# Altium schematic sheet ImprovedBlackPill.SchDoc
size A4; SheetNumber: 1; SheetTotal: 3
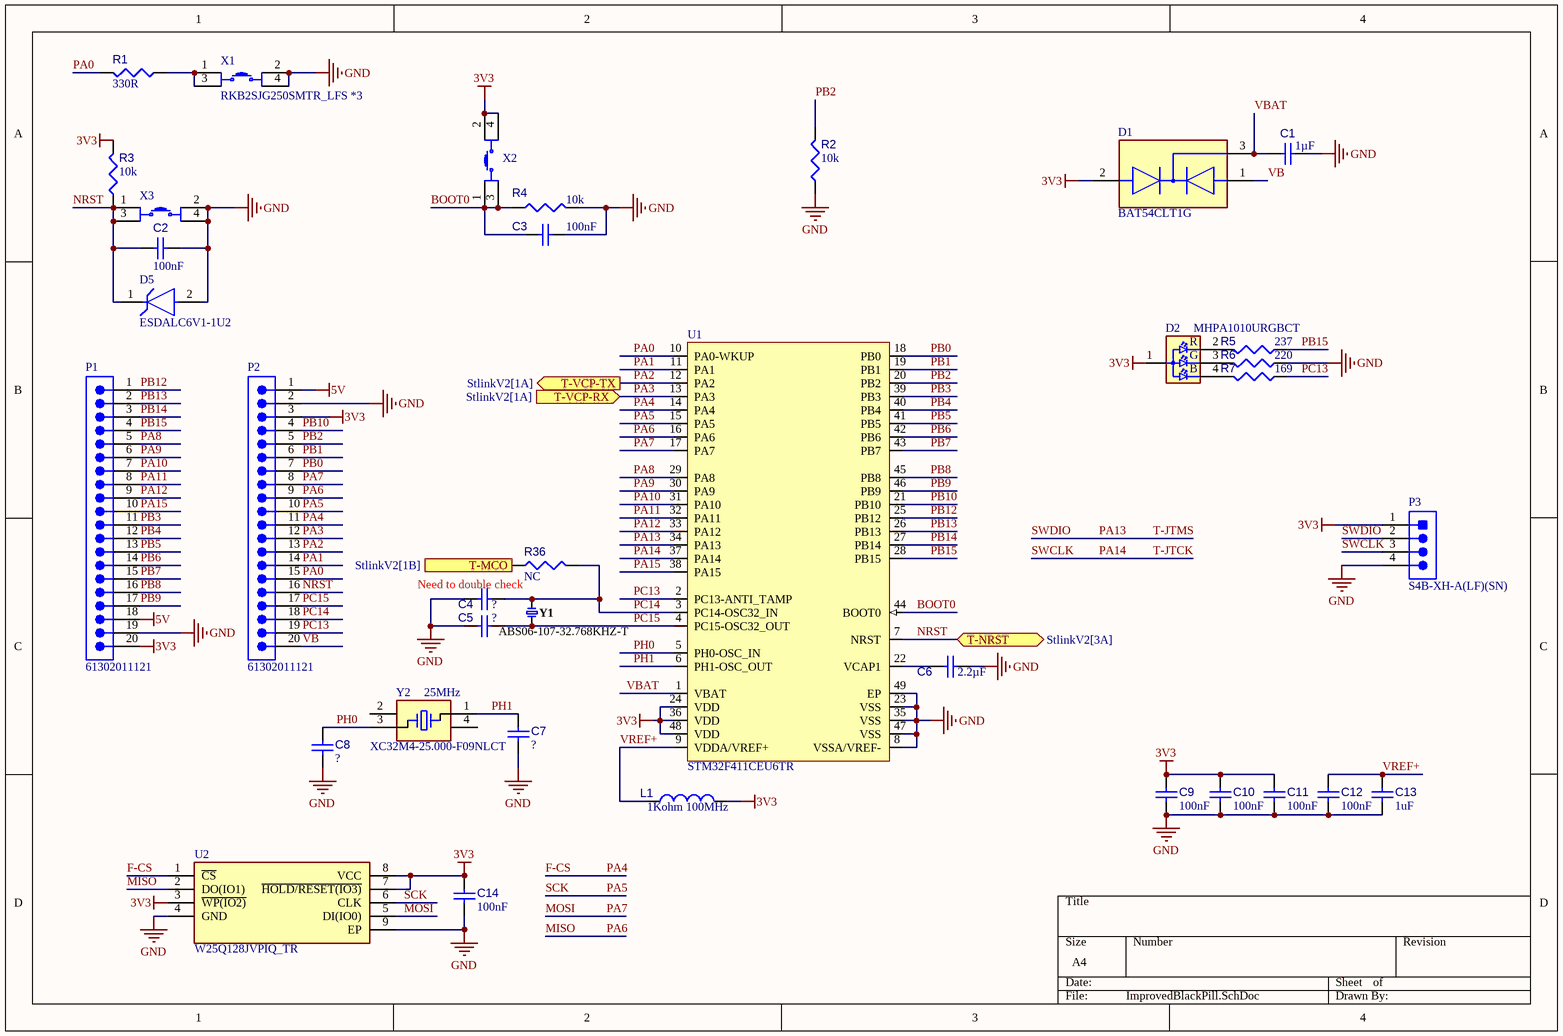
[diagram p0: ImprovedBlackPill.SchDoc]

## Parts
C1  value 1µF  [CAPC1005X55X25ML05T10]  (hidden comment: Capacitor 1 uF +/- 10% 6.3 V 0402)
C2  value 100nF  [CAPC1005X55X25ML05T05]  (hidden comment: Capacitor 10 pF +/- 5% 50 V 0402)
C3  value 100nF  [CAPC1005X55X25ML05T05]  (hidden comment: Capacitor 10 pF +/- 5% 50 V 0402)
C4  Capacitor 10 pF +/- 5% 50 V 0402  [CAPC1005X55X25ML05T05]  (value not drawn)
C5  Capacitor 10 pF +/- 5% 50 V 0402  [CAPC1005X55X25ML05T05]  (value not drawn)
C6  value 2.2µF  [CAPC2013X135X45NL10T25]  (hidden comment: Capacitor 1 uF +/- 10% 50 V 0805)
C7  Capacitor 10 pF +/- 5% 50 V 0402  [CAPC1005X55X25ML05T05]  (value not drawn)
C8  Capacitor 10 pF +/- 5% 50 V 0402  [CAPC1005X55X25ML05T05]  (value not drawn)
C9  value 100nF  [CAPC1005X55X25ML05T05]  (hidden comment: Capacitor 10 pF +/- 5% 50 V 0402)
C10  value 100nF  [CAPC1005X55X25ML05T05]  (hidden comment: Capacitor 10 pF +/- 5% 50 V 0402)
C11  value 100nF  [CAPC1005X55X25ML05T05]  (hidden comment: Capacitor 10 pF +/- 5% 50 V 0402)
C12  value 100nF  [CAPC1005X55X25ML05T05]  (hidden comment: Capacitor 10 pF +/- 5% 50 V 0402)
C13  value 1uF  [CAPC1005X55X25ML05T05]  (hidden comment: Capacitor 10 pF +/- 5% 50 V 0402)
C14  value 100nF  [CAPC1005X55X25ML05T05]  (hidden comment: Capacitor 10 pF +/- 5% 50 V 0402)
D1  BAT54CLT1G  [FP-318-08-IPC_C]
D2  MHPA1010URGBCT  [FP-SML-LX0404SIUPGUSB-MFG]
D5  ESDALC6V1-1U2  [FP-ST0201-MFG]
L1  value 1Kohm 100MHz  [MURA-LQP15MN3N6B02D-2_N]  (hidden comment: LQP15MN3N6B02D)
P1  61302011121  [61302011121]
P2  61302011121  [61302011121]
P3  S4B-XH-A(LF)(SN)  [JST-S4B-XH-A(LF)(SN)_V]
R1  value 330R  [RESC1005X40X25ML10T10]  (hidden comment: Resistor 15k +/-1% 0402 63 mW)
R2  value 10k  [RESC1005X40X25ML10T10]  (hidden comment: Resistor 15k +/-1% 0402 63 mW)
R3  value 10k  [RESC1005X40X25ML10T10]  (hidden comment: Resistor 15k +/-1% 0402 63 mW)
R4  value 10k  [RESC1005X40X25ML10T10]  (hidden comment: Resistor 15k +/-1% 0402 63 mW)
R5  value 237  [RESC1005X40X25ML10T10]  (hidden comment: Resistor 15k +/-1% 0402 63 mW)
R6  value 220  [RESC1005X40X25ML10T10]  (hidden comment: Resistor 15k +/-1% 0402 63 mW)
R7  value 169  [RESC1005X40X25ML10T10]  (hidden comment: Resistor 15k +/-1% 0402 63 mW)
R36  value NC  [RESC0402(1005)_L]  (hidden comment: Jumper 0402)
U1  STM32F411CEU6TR  [STM-UFQFPN48_N]
U2  W25Q128JVPIQ_TR  [SON127P600X500X80-9N-D]
X1  RKB2SJG250SMTR_LFS *3  [RKB2SJG250SMTRLFS]
X2  RKB2SJG250SMTR_LFS  [RKB2SJG250SMTRLFS]  (value not drawn)
X3  RKB2SJG250SMTR_LFS  [RKB2SJG250SMTRLFS]  (value not drawn)
Y1  ABS06-107-32.768KHZ-T  [FP-ABS06-MFG]
Y2  XC32M4-25.000-F09NLCT  [830105863709]

## Ports
T-MCO (out, see StlinkV2[1B]), T-NRST (bidir, see StlinkV2[3A]), T-VCP-RX (in, see StlinkV2[1A]), T-VCP-TX (out, see StlinkV2[1A])

## Nets
3V3: C9.2 C10.2 C11.2 C14.2 D1.2(2_ANODE) D2.1(Common_Anode) L1.1 P1.20 P2.3 P3.1 R3.2 U1.24(VDD) U1.36(VDD) U1.48(VDD) U2.3(~{WP}~{(IO2)}) U2.7(~{HOLD/RESET(IO3)}) U2.8(VCC) X2.2(COM_2) X2.4(NO_2)
5V: P1.18 P2.1
GND: C1.2 C2.2 C3.2 C4.1 C5.1 C6.2 C7.1 C8.1 C9.1 C10.1 C11.1 C12.1 C13.1 C14.1 D5.2(A) P1.19 P2.2 P3.4 R2.1 R4.2 R6.1 U1.8(VSSA/VREF-) U1.23(VSS) U1.35(VSS) U1.47(VSS) U1.49(EP) U2.4(GND) U2.9(EP) X1.2(COM_2) X1.4(NO_2) X3.2(COM_2) X3.4(NO_2)
BOOT0: C3.1 R4.1 U1.44(BOOT0) X2.1(COM_1) X2.3(NO_1)
F-CS: P2.11 U1.14(PA4) U2.1(~{CS})  [also labelled PA4]
MISO: P2.9 U1.16(PA6) U2.2(DO(IO1))  [also labelled PA6]
MOSI: P2.8 U1.17(PA7) U2.5(DI(IO0))  [also labelled PA7]
NRST: C2.1 D5.1(C) P2.16 R3.1 U1.7(NRST) X3.1(COM_1) X3.3(NO_1) ; port T-NRST
PA0: P2.15 R1.2 U1.10(PA0-WKUP)
PA1: P2.14 U1.11(PA1)
PA2: P2.13 U1.12(PA2) ; port T-VCP-TX
PA3: P2.12 U1.13(PA3) ; port T-VCP-RX
PA5: P2.10 U1.15(PA5) U2.6(CLK)  [also labelled SCK]
PA8: P1.5 U1.29(PA8)
PA9: P1.6 U1.30(PA9)
PA10: P1.7 U1.31(PA10)
PA11: P1.8 U1.32(PA11)
PA12: P1.9 U1.33(PA12)
PA13: P3.2 U1.34(PA13)  [also labelled SWDIO, T-JTMS]
PA14: P3.3 U1.37(PA14)  [also labelled SWCLK, T-JTCK]
PA15: P1.10 U1.38(PA15)
PB0: P2.7 U1.18(PB0)
PB1: P2.6 U1.19(PB1)
PB2: P2.5 R2.2 U1.20(PB2)
PB3: P1.11 U1.39(PB3)
PB4: P1.12 U1.40(PB4)
PB5: P1.13 U1.41(PB5)
PB6: P1.14 U1.42(PB6)
PB7: P1.15 U1.43(PB7)
PB8: P1.16 U1.45(PB8)
PB9: P1.17 U1.46(PB9)
PB10: P2.4 U1.21(PB10)
PB12: P1.1 U1.25(PB12)
PB13: P1.2 U1.26(PB13)
PB14: P1.3 U1.27(PB14)
PB15: P1.4 R5.1 U1.28(PB15)
PC13: P2.19 R7.1 U1.2(PC13-ANTI_TAMP)
PC14: C4.2 P2.18 R36.2 U1.3(PC14-OSC32_IN) Y1.2
PC15: C5.2 P2.17 U1.4(PC15-OSC32_OUT) Y1.1
PH0: C8.2 U1.5(PH0-OSC_IN) Y2.3(CRYSTAL__2)
PH1: C7.2 U1.6(PH1-OSC_OUT) Y2.1(CRYSTAL__1)
T-MCO: R36.1 ; port T-MCO
VB: D1.1(1_ANODE) P2.20
VBAT: C1.1 D1.3(C) U1.1(VBAT)
VREF+: C12.2 C13.2 L1.2 U1.9(VDDA/VREF+)
NetC6_1: C6.1 U1.22(VCAP1)
NetD2_2: D2.2(Red_C) R5.2
NetD2_3: D2.3(Blue_C) R6.2
NetD2_4: D2.4(B) R7.2
NetR1_1: R1.1 X1.1(COM_1) X1.3(NO_1)

Not connected (* = marked no-connect by the designer): Y2 2(GND_&_LID_1) 4(GND_&_LID_2)

## Notes on the sheet
- Need to double check
- (near Y2) 25MHz
- (in symbol CMP-007-00037-2) R; G

## Library data of the parts
C1 = CMP-001-00008-7: Chip Capacitor, 1 uF, +/- 10%, 6.3 V, 0402 (1005 Metric); Capacitor Type: Ceramic; Voltage Rating: 6.3V; Max Operating Temperature: 85°C; Mounting Technology: SM; Tolerance: 10%; Case/Package: 0402; RoHS Compliant: True; Min Operating Temperature: -55°C; Pins: 2
C2 C4 C5 C9 = CMP-001-00013-7: Chip Capacitor, 10 pF, +/- 5%, 50 V, 0402 (1005 Metric); Capacitor Type: Ceramic; Voltage Rating: 50V; Max Operating Temperature: 125°C; Pins: 2; Mounting Technology: SM; Tolerance: 5%; RoHS Compliant: True; Case/Package: 0402; Min Operating Temperature: -55°C
  C4 C5: Value: ?
C3 C7 C8 C10-C14 = CMP-001-00013-6: Chip Capacitor, 10 pF, +/- 5%, 50 V, 0402 (1005 Metric); Capacitor Type: Ceramic; Voltage Rating: 50V; Max Operating Temperature: 125°C; Pins: 2; Mounting Technology: SM; Tolerance: 5%; RoHS Compliant: True; Case/Package: 0402; Min Operating Temperature: -55°C
  C7 C8: Value: ?
C6 = CMP-001-00007-6: Chip Capacitor, 1 uF, +/- 10%, 50 V, 0805 (2012 Metric); Capacitor Type: Ceramic; Voltage Rating: 50V; Min Operating Temperature: -55°C; RoHS Compliant: True; Mounting Technology: SM; Case/Package: 0805; Max Operating Temperature: 125°C; Tolerance: 10%; Pins: 2
D1 = CMP-00000-1: Rectifier Diode, Schottky, 2 Element, 0.1A, 30V V(RRM), Silicon, TO-236; Reverse Recovery Time-Max: 0.005us; Max Power Dissipation: 225mW; Max Output current: 100mA; Non-rep Pk Forward Current-Max: 600mA; Qualification Status: Not Qualified; Package Body Material: Plastic; Forward Voltage: 240mV; Time @ Peak Reflow Temperature-Max (s): 40s; Number of Elements: 2; Terminal Finish: Tin; Diode Element Material: SILICON; JESD-609 Code: e3; Peak Reflow Temperature (Cel): 260°C; JEDEC-95 Code: TO-236; Technology: SCHOTTKY; Surface Mount: Yes; Package Shape: Rectangular; RoHS Compliant: Yes; Pins: 3; Moisture Sensitivity Level: 1; Max Operating Temperature: 125°C; Diode Type: RECTIFIER; Terminal Position: DUAL; Terminal Form: Gull Wing; Reach SVHC Compliant: Yes; Package Style: SMALL OUTLINEMeter; JESD-30 Code: R-PDSO-G3; Rep Pk Reverse Voltage-Max: 30V; Min Operating Temperature: -55°C
D2 = CMP-007-00037-2
D5 = CMP-004-00076-1: Trans Voltage Suppressor Diode, 20W, Unidirectional, 1 Element, Silicon; Max Operating Temperature: 125°C; Pins: 2; RoHS Compliant: Yes
L1 = CMP-006-00010-6: Inductor, 500 MHz, 170 mA, 0.5 Ohm, -40 to 85 degC, 01005 (0402 Metric), RoHS, Tape and Reel; Manufacturer: Murata; Core Material: Ferrite; Self Resonant Frequency: 6GHz; Current Rating: 170mA; Shielding: Unshielded; Q Factor: 13; Datasheet URL: http://download.siliconexpert.com/pdfs/2016/4/21/8/25/31/646/mrt_/manual/797549851250188lqp15mn3n6b0223.pdf; Datasheet Version: Apr-16; Case/Package: 0402; Mounting Technology: SM; Min Operating Temperature: -40°C; RoHS Compliant: True; Package Description: 2-Pin Surface Mount Device, Body 1 x 0.5 mm; Max Operating Temperature: 85°C; Package Quantity: 10000; Package Reference: 0402; Packaging: TapeandReel
P1 P2 = CMP-002-00071-1: Board Connector, 20 Contact(s), 1 Row(s), Male, Straight, 0.1 inch Pitch, Solder Terminal, Locking, Black Insulator, Plug; RoHS Compliant: Yes; Min Operating Temperature: -40°C; Mounting Technology: Board; Connector Type: BOARD CONNECTOR; Max Operating Temperature: 125°C
P3 = CMP-002-00034-2: Male Header, Pitch 2.5 mm, 1 x 4 Position, Height 6.1 mm, Tail Length 3.4 mm, -25 to 85 degC, RoHS, Bulk; Manufacturer: JST; Manufacturer URL: http://www.jst.com/home2.html; RoHS Compliant: Unknown; Gender: Male; Min Operating Temperature: -25°C; Datasheet URL: http://www.jst-mfg.com/product/pdf/eng/eXH.pdf; Case/Package: S4B-XH-A(LF)(SN); Datasheet Version: May-16; Mounting Technology: TH; Package Reference: S4B-XH-A(LF)(SN); Max Operating Temperature: 85°C; Package Description: XH Series Disconnectable Crimp Style Connector, Pitch 2.5 mm, 1 x 4 Position, Height 6.1 mm, Tail Length 3.4 mm; Connector Type: Header
R1-R7 = CMP-009-00026-5: Chip Resistor, 15 KOhm, +/- 1%, 0.063 W, -55 to 155 degC, 0402 (1005 Metric); Power: 63mW; Min Operating Temperature: -55°C; Tolerance: 1%; Max Operating Temperature: 155°C; Mounting Technology: SM; Case/Package: 0402; RoHS Compliant: True; Pins: 2
R36 = CMP-009-00148-3: Pins: 2; Max Operating Temperature: 155°C; Min Operating Temperature: -55°C; Case/Package: 0402
U1 = CMP-020-00023-2: RISC Microcontroller, 32-Bit, FLASH, CORTEX-M4 CPU, 100MHz, CMOS; Nominal Supply Voltage: 3.3V; Max Supply Voltage: 3.6V; Min Supply Voltage: 1.7V; RoHS Compliant: Yes; Max Operating Temperature: 85°C; Case/Package: HVQCCN; Min Operating Temperature: -40°C; Pins: 48
U2 = CMP-037-000000-3: NOR Flash spiFlash, 3V, 128M-bit, 4Kb Uniform Sector; Manufacturer_Part_Number: W25Q128JVPIQ TR; Manufacturer_Name: Winbond; Geometry.Height: 0.8mm; Source: W25Q128JVPIQ_TR.SchLib; Mouser Part Number: 454-W25Q128JVPIQTR; Design Item ID: W25Q128JVPIQ_TR; Datasheet Link: https://www.winbond.com/resource-files/w25q128jv%20revf%2003272018%20plus.pdf; Mouser Price/Stock: https://www.mouser.co.uk/ProductDetail/Winbond/W25Q128JVPIQ-TR?qs=qSfuJ%252Bfl%2Fd6H7vbXyrDu3w%3D%3D
X1-X3 = CMP-008-000000-3: Tactile Switches J Bend SMT Term 400gf Force; Manufacturer_Part_Number: RKB2SJG250SMTR LFS; Manufacturer_Name: C & K COMPONENTS; Geometry.Height: 2.7mm; Mouser Part Number: 611-RKB2SJG250SMTRLF; Datasheet Link: https://www.ckswitches.com/media/3130/ck_rk_datasheet.pdf; Mouser Price/Stock: https://www.mouser.co.uk/ProductDetail/CK/RKB2SJG250SMTR-LFS?qs=iLbezkQI%252Bsgsc0TY%2FPaT8A%3D%3D; Source: RKB2SJG250SMTR_LFS.SchLib; Design Item ID: RKB2SJG250SMTR_LFS
Y1 = CMP-003-00037-1: Parallel - Fundamental Quartz Crystal, 0.032768MHz Nom; Load Capacitance: 4pF; ESR: 80k; Mounting Technology: Surface Mount; Min Operating Temperature: -40°C; Max Operating Temperature: 85°C; RoHS Compliant: Yes
Y2 = CMP-003-000311-1: XC32M4-25.000-F09NLCT Cload 9pF; Frequency: 25MHz; Load Capacitance: 9pF; Case/Package: 3.2 x 2.5mm